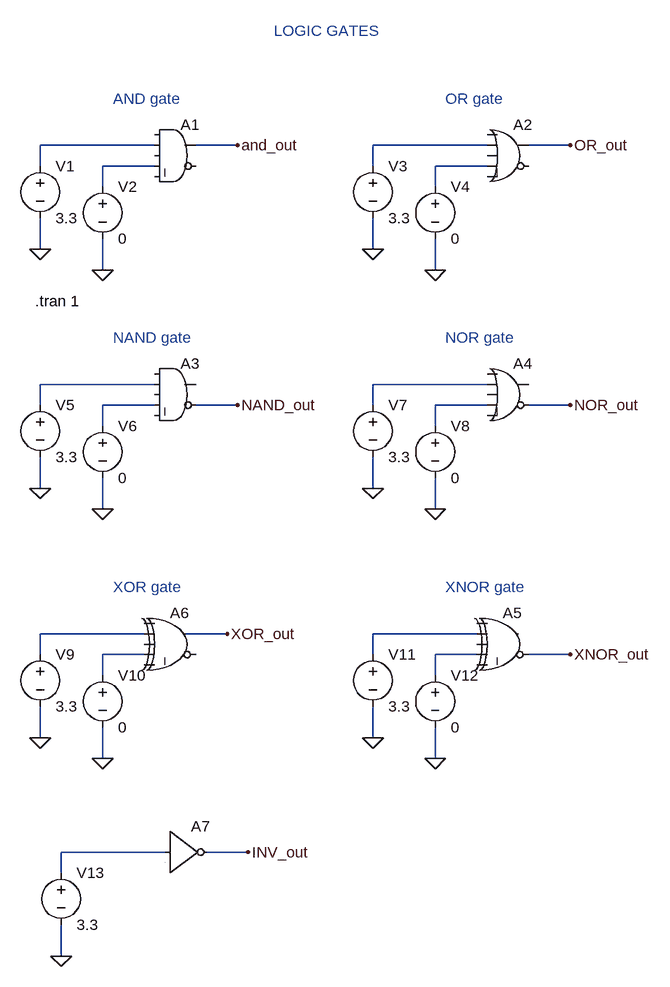
[diagram p0: schematic Logic gates.asc]
Logic gates.asc, the LTspice schematic file:
Version 4
SHEET 1 1124 1396
WIRE 64 128 -112 128
WIRE 192 128 128 128
WIRE 576 128 400 128
WIRE 704 128 640 128
WIRE -112 160 -112 128
WIRE 64 160 -16 160
WIRE 400 160 400 128
WIRE 576 160 496 160
WIRE -16 192 -16 160
WIRE 496 192 496 160
WIRE -112 288 -112 240
WIRE 400 288 400 240
WIRE -16 320 -16 272
WIRE 496 320 496 272
WIRE 64 496 -112 496
WIRE 576 496 400 496
WIRE -112 528 -112 496
WIRE 64 528 -16 528
WIRE 192 528 128 528
WIRE 400 528 400 496
WIRE 576 528 496 528
WIRE 704 528 640 528
WIRE -16 560 -16 528
WIRE 496 560 496 528
WIRE -112 656 -112 608
WIRE 400 656 400 608
WIRE -16 688 -16 640
WIRE 496 688 496 640
WIRE 48 880 -112 880
WIRE 176 880 112 880
WIRE 560 880 400 880
WIRE -112 912 -112 880
WIRE 48 912 -16 912
WIRE 400 912 400 880
WIRE 560 912 496 912
WIRE 704 912 640 912
WIRE -16 944 -16 912
WIRE 496 944 496 912
WIRE -112 1040 -112 992
WIRE 400 1040 400 992
WIRE -16 1072 -16 1024
WIRE 496 1072 496 1024
WIRE 80 1216 -80 1216
WIRE 208 1216 144 1216
WIRE -80 1248 -80 1216
WIRE -80 1376 -80 1328
FLAG -112 288 0
FLAG 192 128 and_out
FLAG -16 320 0
FLAG 400 288 0
FLAG 704 128 OR_out
FLAG 496 320 0
FLAG -112 656 0
FLAG 192 528 NAND_out
FLAG -16 688 0
FLAG 400 656 0
FLAG 704 528 NOR_out
FLAG 496 688 0
FLAG -112 1040 0
FLAG 176 880 XOR_out
FLAG -16 1072 0
FLAG 400 1040 0
FLAG 704 912 XNOR_out
FLAG 496 1072 0
FLAG -80 1376 0
FLAG 208 1216 INV_out
SYMBOL Digital\\and 96 80 R0
SYMATTR InstName A1
SYMBOL voltage -112 144 R0
SYMATTR InstName V1
SYMATTR Value 3.3
SYMBOL voltage -16 176 R0
SYMATTR InstName V2
SYMATTR Value 0
SYMBOL voltage 400 144 R0
SYMATTR InstName V3
SYMATTR Value 3.3
SYMBOL voltage 496 176 R0
SYMATTR InstName V4
SYMATTR Value 0
SYMBOL Digital\\or 608 80 R0
SYMATTR InstName A2
SYMBOL Digital\\and 96 448 R0
SYMATTR InstName A3
SYMBOL voltage -112 512 R0
SYMATTR InstName V5
SYMATTR Value 3.3
SYMBOL voltage -16 544 R0
SYMATTR InstName V6
SYMATTR Value 0
SYMBOL voltage 400 512 R0
SYMATTR InstName V7
SYMATTR Value 3.3
SYMBOL voltage 496 544 R0
SYMATTR InstName V8
SYMATTR Value 0
SYMBOL Digital\\or 608 448 R0
SYMATTR InstName A4
SYMBOL voltage -112 896 R0
SYMATTR InstName V9
SYMATTR Value 3.3
SYMBOL voltage -16 928 R0
SYMATTR InstName V10
SYMATTR Value 0
SYMBOL Digital\\xor 96 832 R0
SYMATTR InstName A6
SYMBOL voltage 400 896 R0
SYMATTR InstName V11
SYMATTR Value 3.3
SYMBOL voltage 496 928 R0
SYMATTR InstName V12
SYMATTR Value 0
SYMBOL Digital\\xor 608 832 R0
SYMATTR InstName A5
SYMBOL Digital\\inv 80 1152 R0
SYMATTR InstName A7
SYMBOL voltage -80 1232 R0
SYMATTR InstName V13
SYMATTR Value 3.3
TEXT -120 368 Left 2 !.tran 1
TEXT 0 56 Left 2 ;AND gate
TEXT 248 -48 Left 2 ;LOGIC GATES
TEXT 512 56 Left 2 ;OR gate
TEXT 0 424 Left 2 ;NAND gate
TEXT 512 424 Left 2 ;NOR gate
TEXT 0 808 Left 2 ;XOR gate
TEXT 512 808 Left 2 ;XNOR gate

The netlist it stands for:
* Logic gates.asc
A1 0 N001 0 N003 0 0 and_out 0 AND
V1 N001 0 3.3
V2 N003 0 0
V3 N002 0 3.3
V4 N004 0 0
A2 0 N002 0 N004 0 0 OR_out 0 OR
A3 0 N005 0 N007 0 NAND_out 0 0 AND
V5 N005 0 3.3
V6 N007 0 0
V7 N006 0 3.3
V8 N008 0 0
A4 0 N006 0 N008 0 NOR_out 0 0 OR
V9 N009 0 3.3
V10 N011 0 0
A6 0 N009 0 N011 0 0 XOR_out 0 XOR
V11 N010 0 3.3
V12 N012 0 0
A5 0 N010 0 N012 0 XNOR_out 0 0 XOR
A7 N013 0 0 0 0 INV_out 0 0 BUF
V13 N013 0 3.3
.tran 1
* AND gate
* LOGIC GATES
* OR gate
* NAND gate
* NOR gate
* XOR gate
* XNOR gate
.backanno
.end